# Altium project minisat_v0_1.PrjPcb
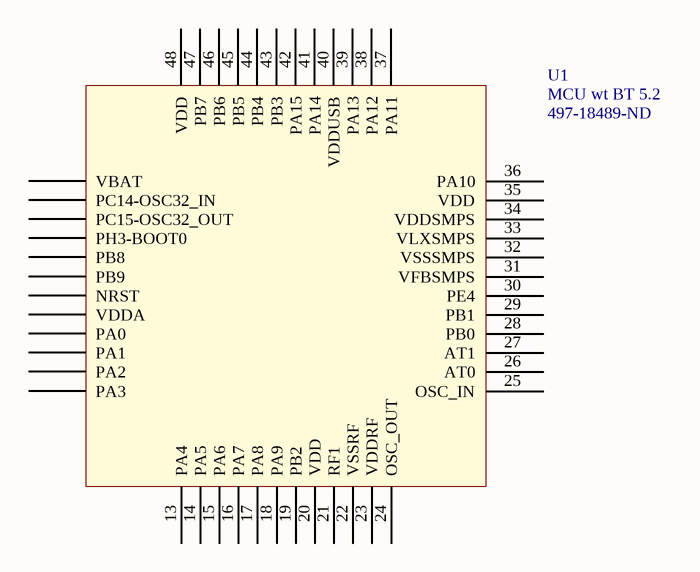
[diagram p0: minisat_v0_1.SchDoc]
1 sheet, 1 parts. Net scope: global (net labels, ports and power ports of the same name join across sheets).

## Sheet minisat_v0_1.SchDoc
size A4; SheetNumber: 1; SheetTotal: 1

### Parts
U1  MCU wt BT 5.2  Supplier Part Number 1: 497-18489-ND

### Nets

Not connected (* = marked no-connect by the designer): U1 1(VBAT) 2(PC14-OSC32_IN) 3(PC15-OSC32_OUT) 4(PH3-BOOT0) 5(PB8) 6(PB9) 7(NRST) 8(VDDA) 9(PA0) 10(PA1) 11(PA2) 12(PA3) 13(PA4) 14(PA5) 15(PA6) 16(PA7) 17(PA8) 18(PA9) 19(PB2) 20(VDD) 21(RF1) 22(VSSRF) 23(VDDRF) 24(OSC_OUT) 25(OSC_IN) 26(AT0) 27(AT1) 28(PB0) 29(PB1) 30(PE4) 31(VFBSMPS) 32(VSSSMPS) 33(VLXSMPS) 34(VDDSMPS) 35(VDD) 36(PA10) 37(PA11) 38(PA12) 39(PA13) 40(VDDUSB) 41(PA14) 42(PA15) 43(PB3) 44(PB4) 45(PB5) 46(PB6) 47(PB7) 48(VDD)

### Library data of the parts
U1 = STM32WB55CGU6: MCU 32-Bit STM32WB55 ARM Cortex M4 RISC 1MB Flash 1.7V to 3.6V 48-Pin UFQFPN Tray; Manufacturer: STMicroelectronics; Supplier 1: Digi-Key; Manufacturer Part Number: STM32WB55CGU6; RoHS: Yes; Category: Microcontrollers; Stock 1: 958; Pricing 1: 1=11,09000, 10=10,02000, 25=9,55400, 80=8,29563, 260=7,92273, 520=7,76740 (USD); ComponentLink1URL: http://www.farnell.com/datasheets/2792352.pdf?src-supplier=Farnell; ComponentLink1Description: http://www.farnell.com/datasheets/2792352.pdf?src-supplier=Farnell; ComponentLink2URL: http://www.farnell.com/datasheets/2792352.pdf?src-supplier=Element14; ComponentLink2Description: http://www.farnell.com/datasheets/2792352.pdf?src-supplier=Element14; ComponentLink3URL: http://www.farnell.com/datasheets/2792352.pdf?src-supplier=Newark; ComponentLink3Description: http://www.farnell.com/datasheets/2792352.pdf?src-supplier=Newark